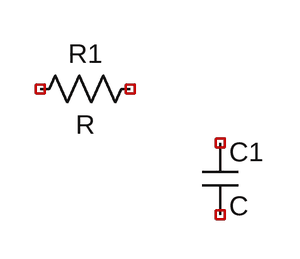
[diagram p0: schematic Draft1.asc]
Draft1.asc, the LTspice schematic file:
Version 4
SHEET 1 880 680
SYMBOL cap 160 144 R0
SYMATTR InstName C1
SYMBOL res 112 80 R90
WINDOW 0 0 56 VBottom 2
WINDOW 3 32 56 VTop 2
SYMATTR InstName R1

The netlist it stands for:
* Draft1.asc
C1 NC_01 NC_02 C
R1 NC_03 NC_04 R
.backanno
.end